# EAGLE schematic main_board_mpu_off_center (EAGLE 9.5.2)
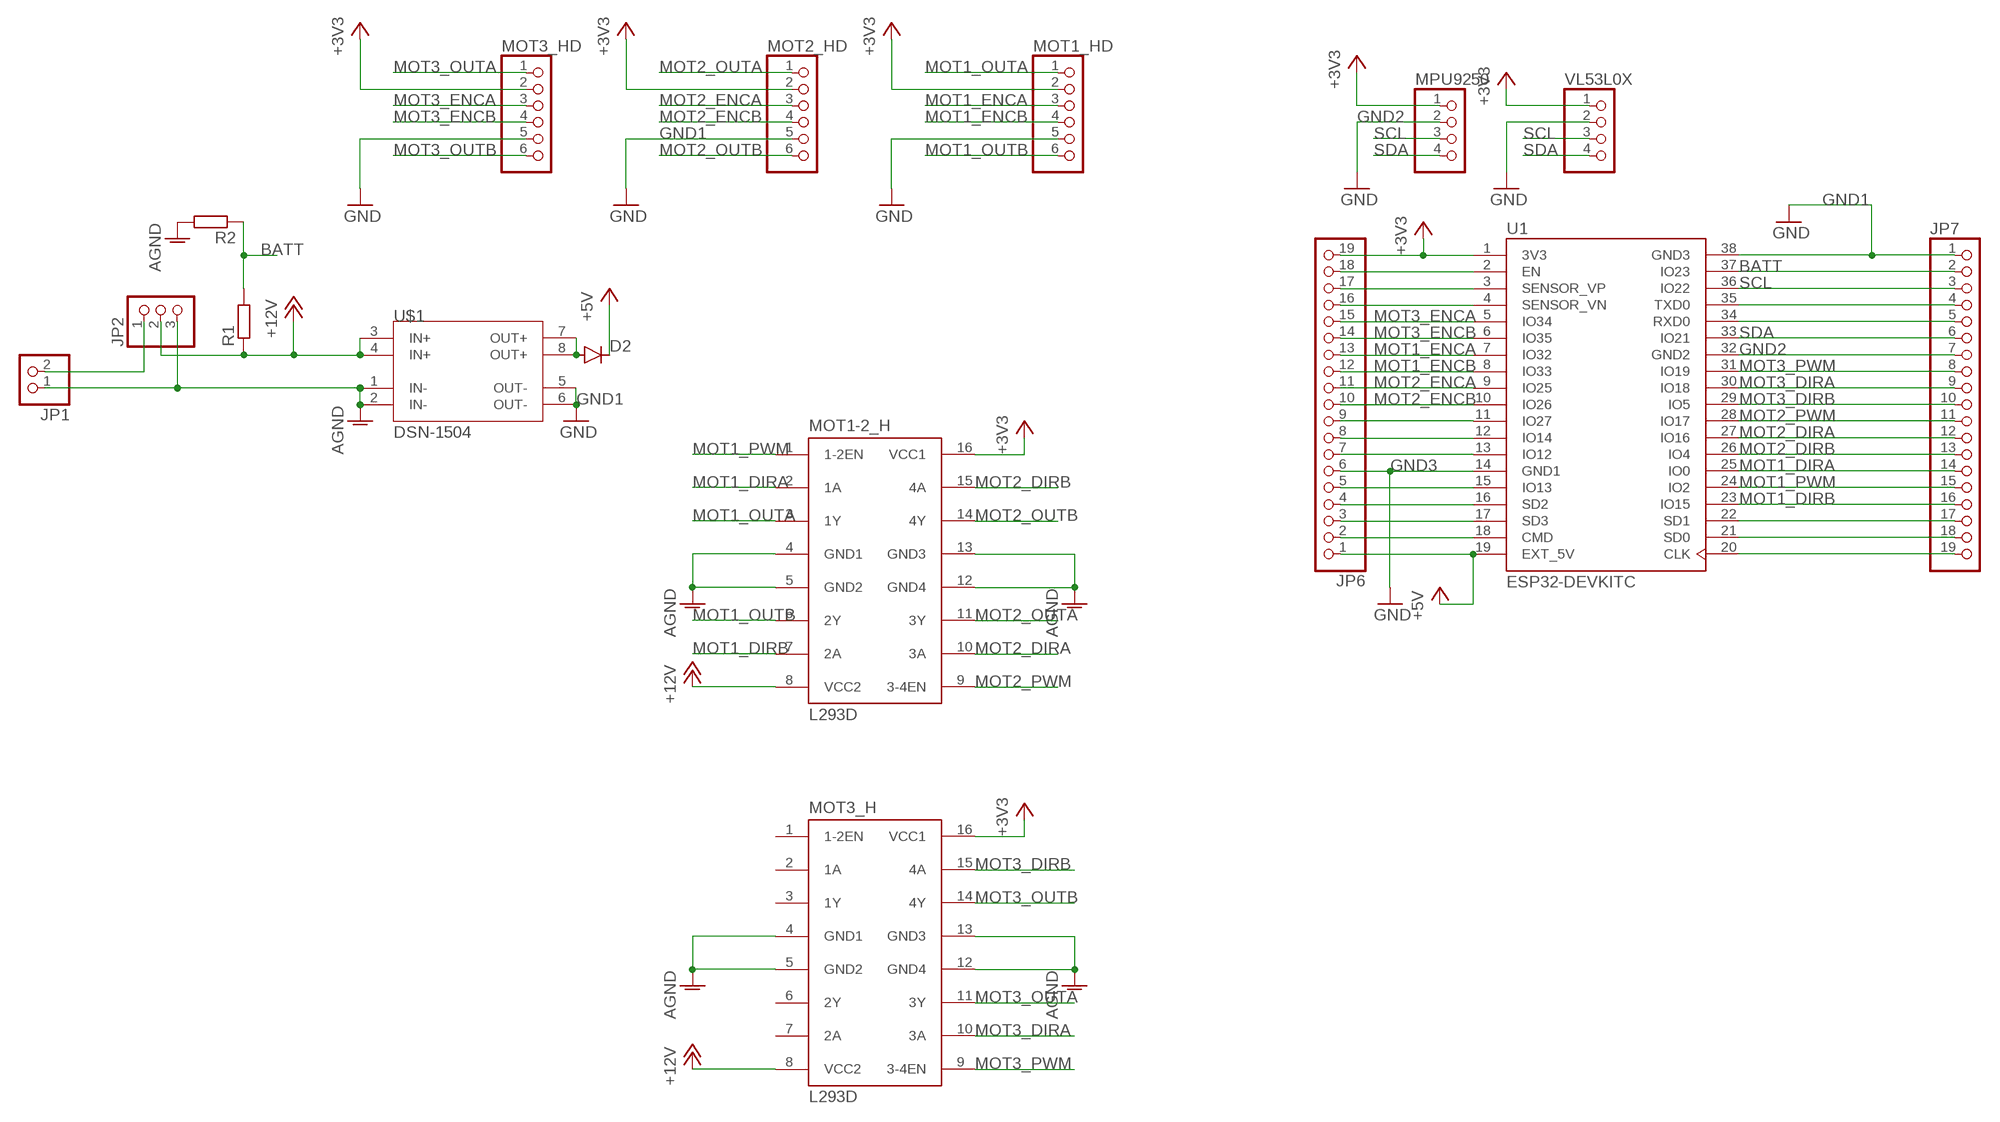
[diagram p0: schematic, sheet 1]

## Parts
D2  DIODE-DO27-15  [DO27-15]
JP1  PINHD-1X2  [1X02]
JP2  PINHD-1X3  [1X03]
JP6  PINHD-1X19  [1X19]
JP7  PINHD-1X19  [1X19]
MOT1-2_H  L293D  [DIL16]
MOT1_HD  PINHD-1X6  [1X06]
MOT2_HD  PINHD-1X6  [1X06]
MOT3_H  L293D  [DIL16]
MOT3_HD  PINHD-1X6  [1X06]
MPU9250  PINHD-1X4  [1X04]
R1  R-EU_R0805  [R0805]
R2  R-EU_R0805  [R0805]
U1  ESP32-DEVKITC  [MODULE_ESP32-DEVKITC]
U$1  DSN-1504  [DSN-1504]
VL53L0X  PINHD-1X4  [1X04]

## Nets
+3V3: JP6.19 MOT1-2_H.16(VCC1) MOT1_HD.2 MOT2_HD.2 MOT3_H.16(VCC1) MOT3_HD.2 MPU9250.1 U1.1(3V3) VL53L0X.1
+5V: D2.C JP6.1 U1.19(EXT_5V)
+12V: JP2.2 MOT1-2_H.8(VCC2) MOT3_H.8(VCC2) R1.1 U$1.3(IN+) U$1.4(IN+)
AGND: JP1.1 JP2.3 MOT1-2_H.4(GND1) MOT1-2_H.5(GND2) MOT1-2_H.12(GND4) MOT1-2_H.13(GND3) MOT3_H.4(GND1) MOT3_H.5(GND2) MOT3_H.12(GND4) MOT3_H.13(GND3) R2.2 U$1.1(IN-) U$1.2(IN-)
BATT: JP7.2 R1.2 R2.1 U1.37(IO23)
GND1: JP7.1 MOT2_HD.5 U1.38(GND3) U$1.5(OUT-) U$1.6(OUT-) ; supply symbol labelled GND
GND2: JP7.7 MPU9250.2 U1.32(GND2) ; supply symbol labelled GND
GND3: JP6.6 MOT1_HD.5 MOT3_HD.5 U1.14(GND1) VL53L0X.2 ; supply symbol labelled GND
MOT1_DIRA: JP7.14 MOT1-2_H.2(1A) U1.25(IO0)
MOT1_DIRB: JP7.16 MOT1-2_H.7(2A) U1.23(IO15)
MOT1_ENCA: JP6.13 MOT1_HD.3 U1.7(IO32)
MOT1_ENCB: JP6.12 MOT1_HD.4 U1.8(IO33)
MOT1_OUTA: MOT1-2_H.3(1Y) MOT1_HD.1
MOT1_OUTB: MOT1-2_H.6(2Y) MOT1_HD.6
MOT1_PWM: JP7.15 MOT1-2_H.1(1-2EN) U1.24(IO2)
MOT2_DIRA: JP7.12 MOT1-2_H.10(3A) U1.27(IO16)
MOT2_DIRB: JP7.13 MOT1-2_H.15(4A) U1.26(IO4)
MOT2_ENCA: JP6.11 MOT2_HD.3 U1.9(IO25)
MOT2_ENCB: JP6.10 MOT2_HD.4 U1.10(IO26)
MOT2_OUTA: MOT1-2_H.11(3Y) MOT2_HD.1
MOT2_OUTB: MOT1-2_H.14(4Y) MOT2_HD.6
MOT2_PWM: JP7.11 MOT1-2_H.9(3-4EN) U1.28(IO17)
MOT3_DIRA: JP7.9 MOT3_H.10(3A) U1.30(IO18)
MOT3_DIRB: JP7.10 MOT3_H.15(4A) U1.29(IO5)
MOT3_ENCA: JP6.15 MOT3_HD.3 U1.5(IO34)
MOT3_ENCB: JP6.14 MOT3_HD.4 U1.6(IO35)
MOT3_OUTA: MOT3_H.11(3Y) MOT3_HD.1
MOT3_OUTB: MOT3_H.14(4Y) MOT3_HD.6
MOT3_PWM: JP7.8 MOT3_H.9(3-4EN) U1.31(IO19)
N$1: JP6.2 U1.18(CMD)
N$2: JP6.3 U1.17(SD3)
N$3: JP6.4 U1.16(SD2)
N$4: JP1.2 JP2.1
N$5: D2.A U$1.7(OUT+) U$1.8(OUT+)
N$6: JP6.8 U1.12(IO14)
N$8: JP6.5 U1.15(IO13)
N$9: JP6.7 U1.13(IO12)
N$11: JP6.9 U1.11(IO27)
N$14: JP6.16 U1.4(SENSOR_VN)
N$15: JP6.17 U1.3(SENSOR_VP)
N$16: JP6.18 U1.2(EN)
N$22: JP7.4 U1.35(TXD0)
N$23: JP7.5 U1.34(RXD0)
N$34: JP7.17 U1.22(SD1)
N$35: JP7.18 U1.21(SD0)
N$36: JP7.19 U1.20(CLK)
SCL: JP7.3 MPU9250.3 U1.36(IO22) VL53L0X.3
SDA: JP7.6 MPU9250.4 U1.33(IO21) VL53L0X.4
Unconnected: MOT3_H.1(1-2EN) MOT3_H.2(1A) MOT3_H.3(1Y) MOT3_H.6(2Y) MOT3_H.7(2A)

## Library data of the parts
D2 = diode:DIODE-: DIODE
JP1 = pinhead:PINHD-1X2: PIN HEADER
JP2 = pinhead:PINHD-1X3: PIN HEADER
JP6 JP7 = pinhead:PINHD-1X19: PIN HEADER
MOT1-2_H MOT3_H = st-microelectronics:L293D: PUSH-PULL 4 CHANNEL DRIVER; MPN: L293D; OC_FARNELL: 9589619; OC_NEWARK: 56P8249
MOT1_HD MOT2_HD MOT3_HD = pinhead:PINHD-1X6: PIN HEADER
MPU9250 VL53L0X = pinhead:PINHD-1X4: PIN HEADER
R1 R2 = rcl:R-EU_: RESISTOR, European symbol; SPICEPREFIX: R
U1 = ESP32-DEVKITC:ESP32-DEVKITC: ESP32-DEVKITC; AVAILABILITY: Unavailable; DESCRIPTION: - Transceiver; 802.11 b/g/n _Wi-Fi, WiFi, WLAN_, Bluetooth® Smart 4.x Low Energy _BLE_ For Use With ESP32-WROOM32; MF: Espressif Systems; MP: ESP32-DevKitC; PACKAGE: None; PRICE: None
U$1 = untitled:DSN-1504